# EAGLE design AS5048 Encoder (EAGLE 7.6.0)
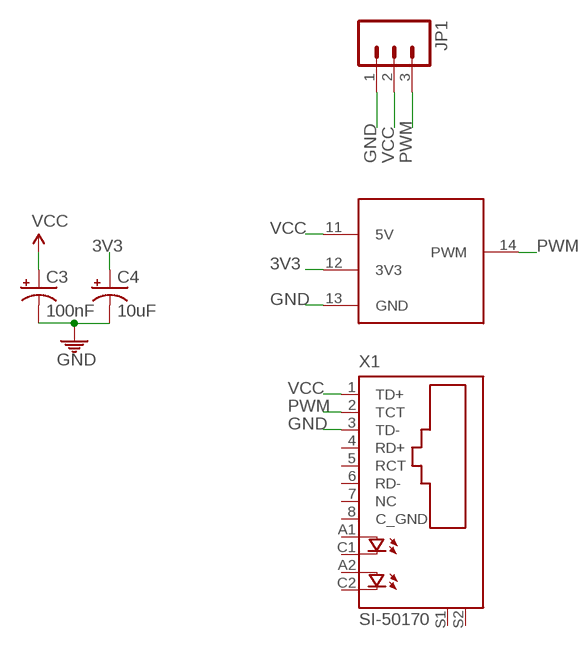
[diagram p0: schematic, sheet 1]

## Parts
C3  100nF  CAP_POL1206-KIT  [EIA3216-KIT]
C4  10uF  CAP_POL1206-KIT  [EIA3216-KIT]
JP1  M03LOCK  [1X03_LOCK]
U$1  AS5048  [TSOP14]
X1  SI-50170  [SI-50170]

## Nets
3V3: C4.A(+) U$1.12(3V3)
GND: C3.C(-) C4.C(-) JP1.1 U$1.13(GND) X1.3(TD-)
PWM: JP1.3 U$1.14(PWM) X1.2(TCT)
VCC: C3.A(+) JP1.2 U$1.11(5V) X1.1(TD+)
Unconnected: X1.4(RD+) X1.5(RCT) X1.6(RD-) X1.7(NC) X1.8(C_GND) X1.A1(A) X1.A2(A1) X1.C1(C) X1.C2(C1) X1.S1 X1.S2

## Library data of the parts
C3 C4 = SparkFun-Passives:CAP_POL: Capacitor Polarized These are standard SMD and PTH capacitors. Normally 10uF, 47uF, and 100uF in electrolytic and tantalum varieties. Always verify the external diameter of the through hole cap, it varies with capacity, voltage, and manufacturer. The EIA devices should be standard.
JP1 = SparkFun-Connectors:M03: Header 3 Standard 3-pin 0.1" header. Use with straight break away headers (SKU : PRT-00116), right angle break away headers (PRT-00553), swiss pins (PRT-00743), machine pins (PRT-00117), and female headers (PRT-00115). Molex polarized connector foot print use with SKU : PRT-08232 with associated crimp pins and housings.
U$1 = austriamicrosystems:AS5048
X1 = con-stewart:SI-50170: Ethernet Connector MagJack (R) Source: www.stewartconnector.com .. si-50170.pdf; OC_FARNELL: unknown; OC_NEWARK: unknown

## Board
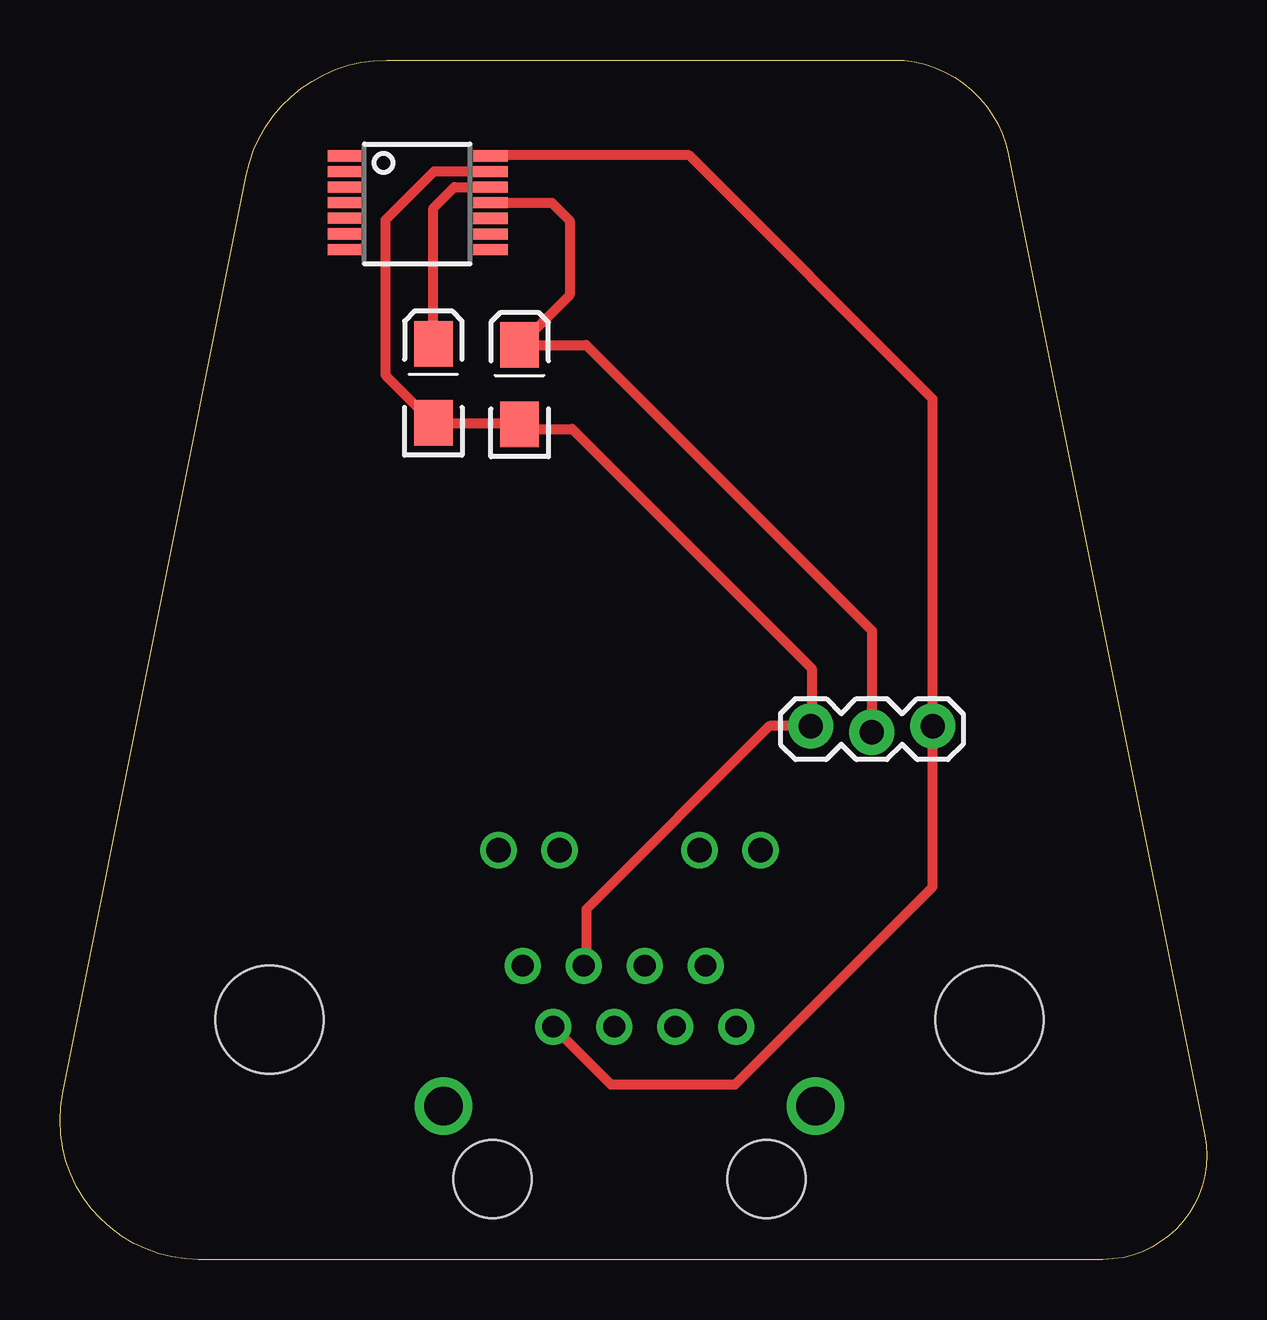
[diagram p1: board, top side]
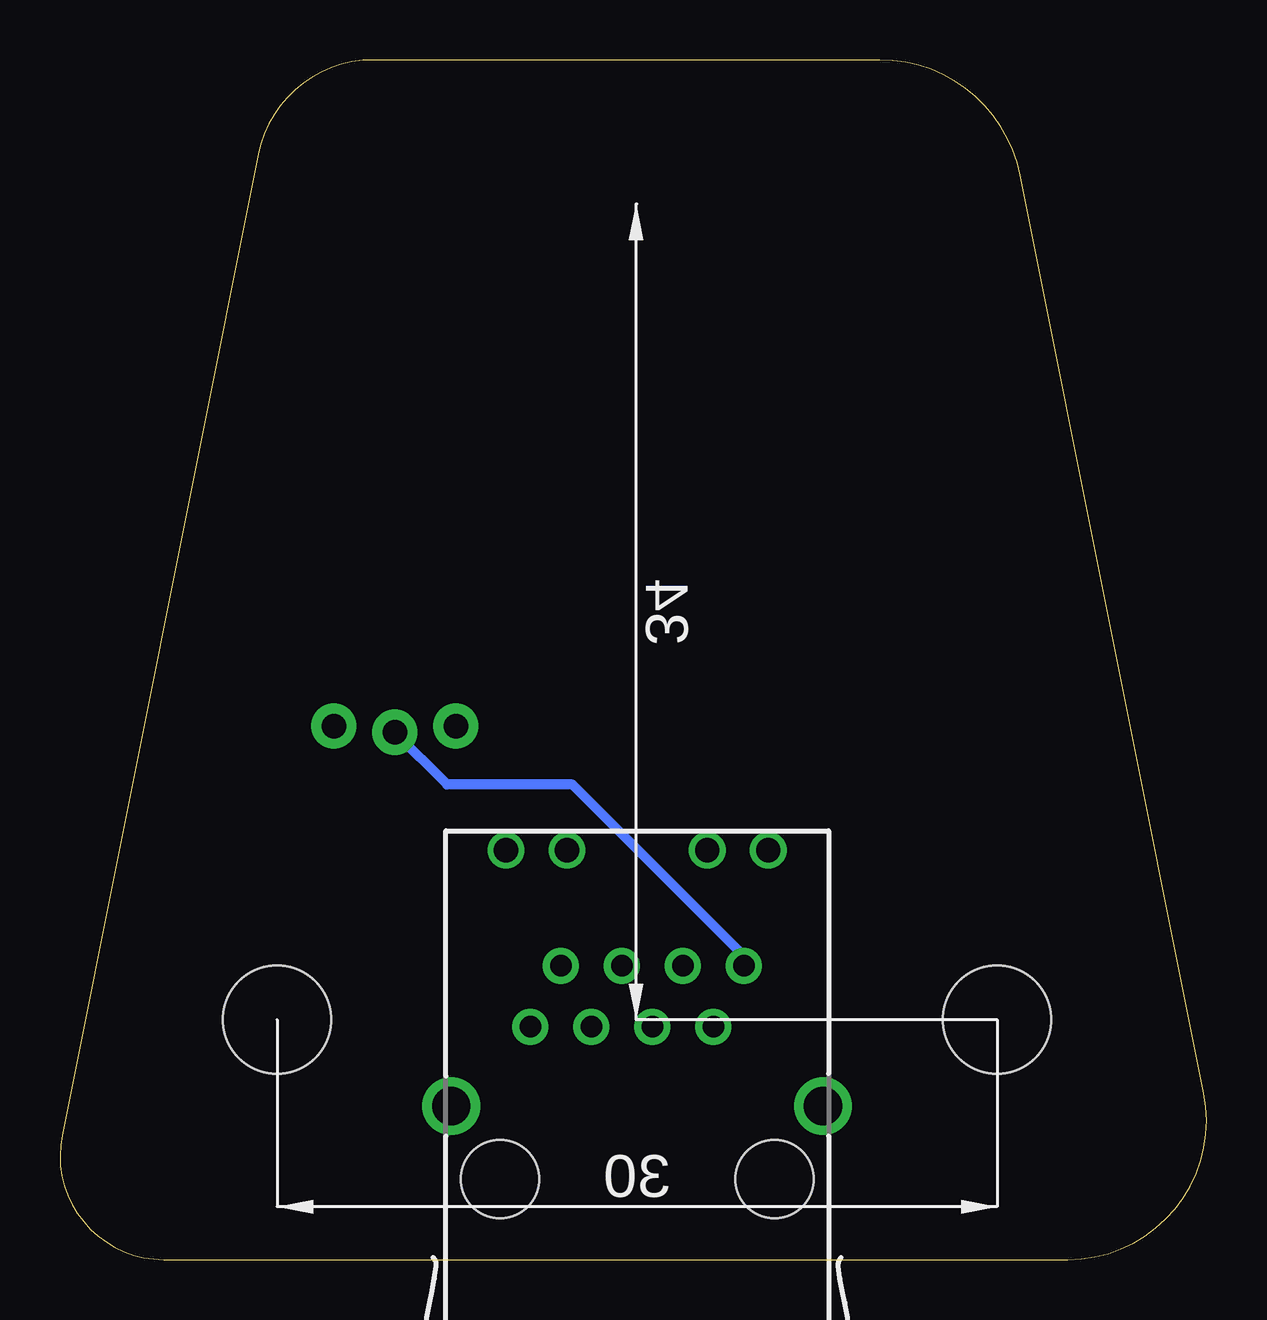
[diagram p2: board, bottom side, seen from below]

Size 47.78 x 50 mm. Coordinates in mm from the lower left corner, seen from the top.
Outline: 43.45,0 5.79,0 arc-101 0.11,6.92 7.77,45.2 arc-79 13.62,50 34.72,50 arc-79 39.51,46.08 47.69,5.18 arc-101 43.45,0
Copper layers (1*16): Top 0.035mm / dielectric 1.5mm / Bottom 0.035mm
Design rules "default": minimum track width 10mil, minimum drill 24mil, track to track 8mil, track to pad 8mil, pad to pad 8mil, via to via 8mil, smd to smd 8mil, copper to edge 40mil, drill to drill 8mil, minimum pad ring 10mil, minimum via ring 8mil, stop-mask expansion 4mil, vias tented up to drill 0mil, thermal gap 10mil
Holes 4.5 mm at 8.73,10 38.73,10

### Footprints (pad centres in the part's own frame; a part is rotated, then mirrored left to right if it is on the bottom)
EIA3216-KIT = smd 1.9 x 1.6: A 1.65,0; C -1.65,0
1X03_LOCK = drill 1.016 pad 1.88: 1 0,0.127; 2 2.54,-0.127; 3 5.08,0.127
TSOP14 = smd 0.46 x 1.43: 1 -2,-3; 2 -1.35,-3; 3 -0.7,-3; 4 -0.05,-3; 5 0.6,-3; 6 1.25,-3; 7 1.9,-3; 8 1.904,3.065; 9 1.254,3.065; 10 0.604,3.065; 11 -0.046,3.065; 12 -0.696,3.065; 13 -1.346,3.065; 14 -2,3.065
SI-50170 = drill 0.9 pad 1.5: 1 4.445,5.842; 2 3.175,3.302; 3 1.905,5.842; 4 0.635,3.302; 5 -0.635,5.842; 6 -1.905,3.302; 7 -3.175,5.842; 8 -4.445,3.302 | drill 1.016 pad 1.5: A1 -5.461,10.668; A2 2.921,10.668; C1 -2.921,10.668; C2 5.461,10.668 | drill 1.6 pad 2.2: S1 -7.747,0; S2 7.747,0 | hole 3.251: -5.715,-3.048; 5.715,-3.048

### Placement (x,y rotation side)
C3  19.15,36.47 90 top
C4  15.56,36.52 90 top
JP1  31.28,22.11 0 top
U$1  14.88,44 270 top
X1  23.73,6.4 0 bottom

### Tracks (layer width: path | path; a pad name or v marks a point on that pad's centre or on a via)
3V3
  Top 0.406: C4.A 15.56,43.83 16.43,44.7 17.93,44.7 U$1.12
GND
  Top 0.406: X1.3 21.93,12.35 21.93,14.6 29.56,22.23 JP1.1 31.32,22.27 31.32,24.64 21.33,34.62 19.3,34.62 19.15,34.77 C3.C 19.09,34.87 C4.C 13.56,36.87 13.56,43.33 15.57,45.35 U$1.13
PWM
  Top 0.406: X1.2 22.95,7.3 28.13,7.3 36.36,15.53 JP1.3 36.36,35.87 26.21,46.02 17.97,46.02 U$1.14
VCC
  Top 0.406: U$1.11 20.49,44.05 21.23,43.31 21.23,40.2 C3.A 21.92,38.12 33.83,26.21 33.83,21.99 JP1.2
  Bottom 0.406: X1.1 19.28,12.65 26.43,19.8 31.64,19.8 JP1.2